# Altium schematic sheet Microcontroller.SchDoc
size A4; DrawnBy: Craig Comberbach; DocumentNumber: 2; Revision: A1; SheetNumber: 2; SheetTotal: 7
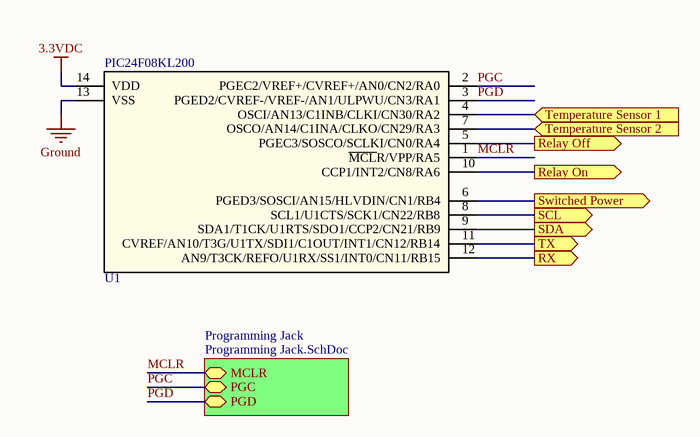
[diagram p0: Microcontroller.SchDoc]

## Parts
U1  PIC24F08KL200

## Sub-sheets
Programming Jack = Programming Jack.SchDoc: MCLR (bidir), PGC (bidir), PGD (bidir)

## Ports
Relay Off (out), Relay On (out), RX (out), SCL (out), SDA (out), Switched Power (out), Temperature Sensor 1 (in), Temperature Sensor 2 (in), TX (out)

## Nets
3.3VDC: U1.14(VDD)
Ground: U1.13(VSS)
MCLR: U1.1(~{MCL}R/VPP/RA5) ; sheet Programming Jack/MCLR
PGC: U1.2(PGEC2/VREF+/CVREF+/AN0/CN2/RA0) ; sheet Programming Jack/PGC
PGD: U1.3(PGED2/CVREF-/VREF-/AN1/ULPWU/CN3/RA1) ; sheet Programming Jack/PGD
Relay Off: U1.5(PGEC3/SOSCO/SCLKI/CN0/RA4) ; port Relay Off
Relay On: U1.10(CCP1/INT2/CN8/RA6) ; port Relay On
RX: U1.12(AN9/T3CK/REFO/U1RX/SS1/INT0/CN11/RB15) ; port RX
SCL: U1.8(SCL1/U1CTS/SCK1/CN22/RB8) ; port SCL
SDA: U1.9(SDA1/T1CK/U1RTS/SDO1/CCP2/CN21/RB9) ; port SDA
Switched Power: U1.6(PGED3/SOSCI/AN15/HLVDIN/CN1/RB4) ; port Switched Power
Temperature Sensor 1: U1.4(OSCI/AN13/C1INB/CLKI/CN30/RA2) ; port Temperature Sensor 1
Temperature Sensor 2: U1.7(OSCO/AN14/C1INA/CLKO/CN29/RA3) ; port Temperature Sensor 2
TX: U1.11(CVREF/AN10/T3G/U1TX/SDI1/C1OUT/INT1/CN12/RB14) ; port TX

## Library data of the parts
U1 = PIC24F08KL200: QuickValue: PIC24F08KL200; Value: PIC24F08KL200; Technology: THT; Supplier 1: Digi-Key; Supplier Part Number 1: PIC24F08KL200-I/P-ND; Package: DIP-14